# EAGLE schematic Fan__control_design (EAGLE 7.7.0)
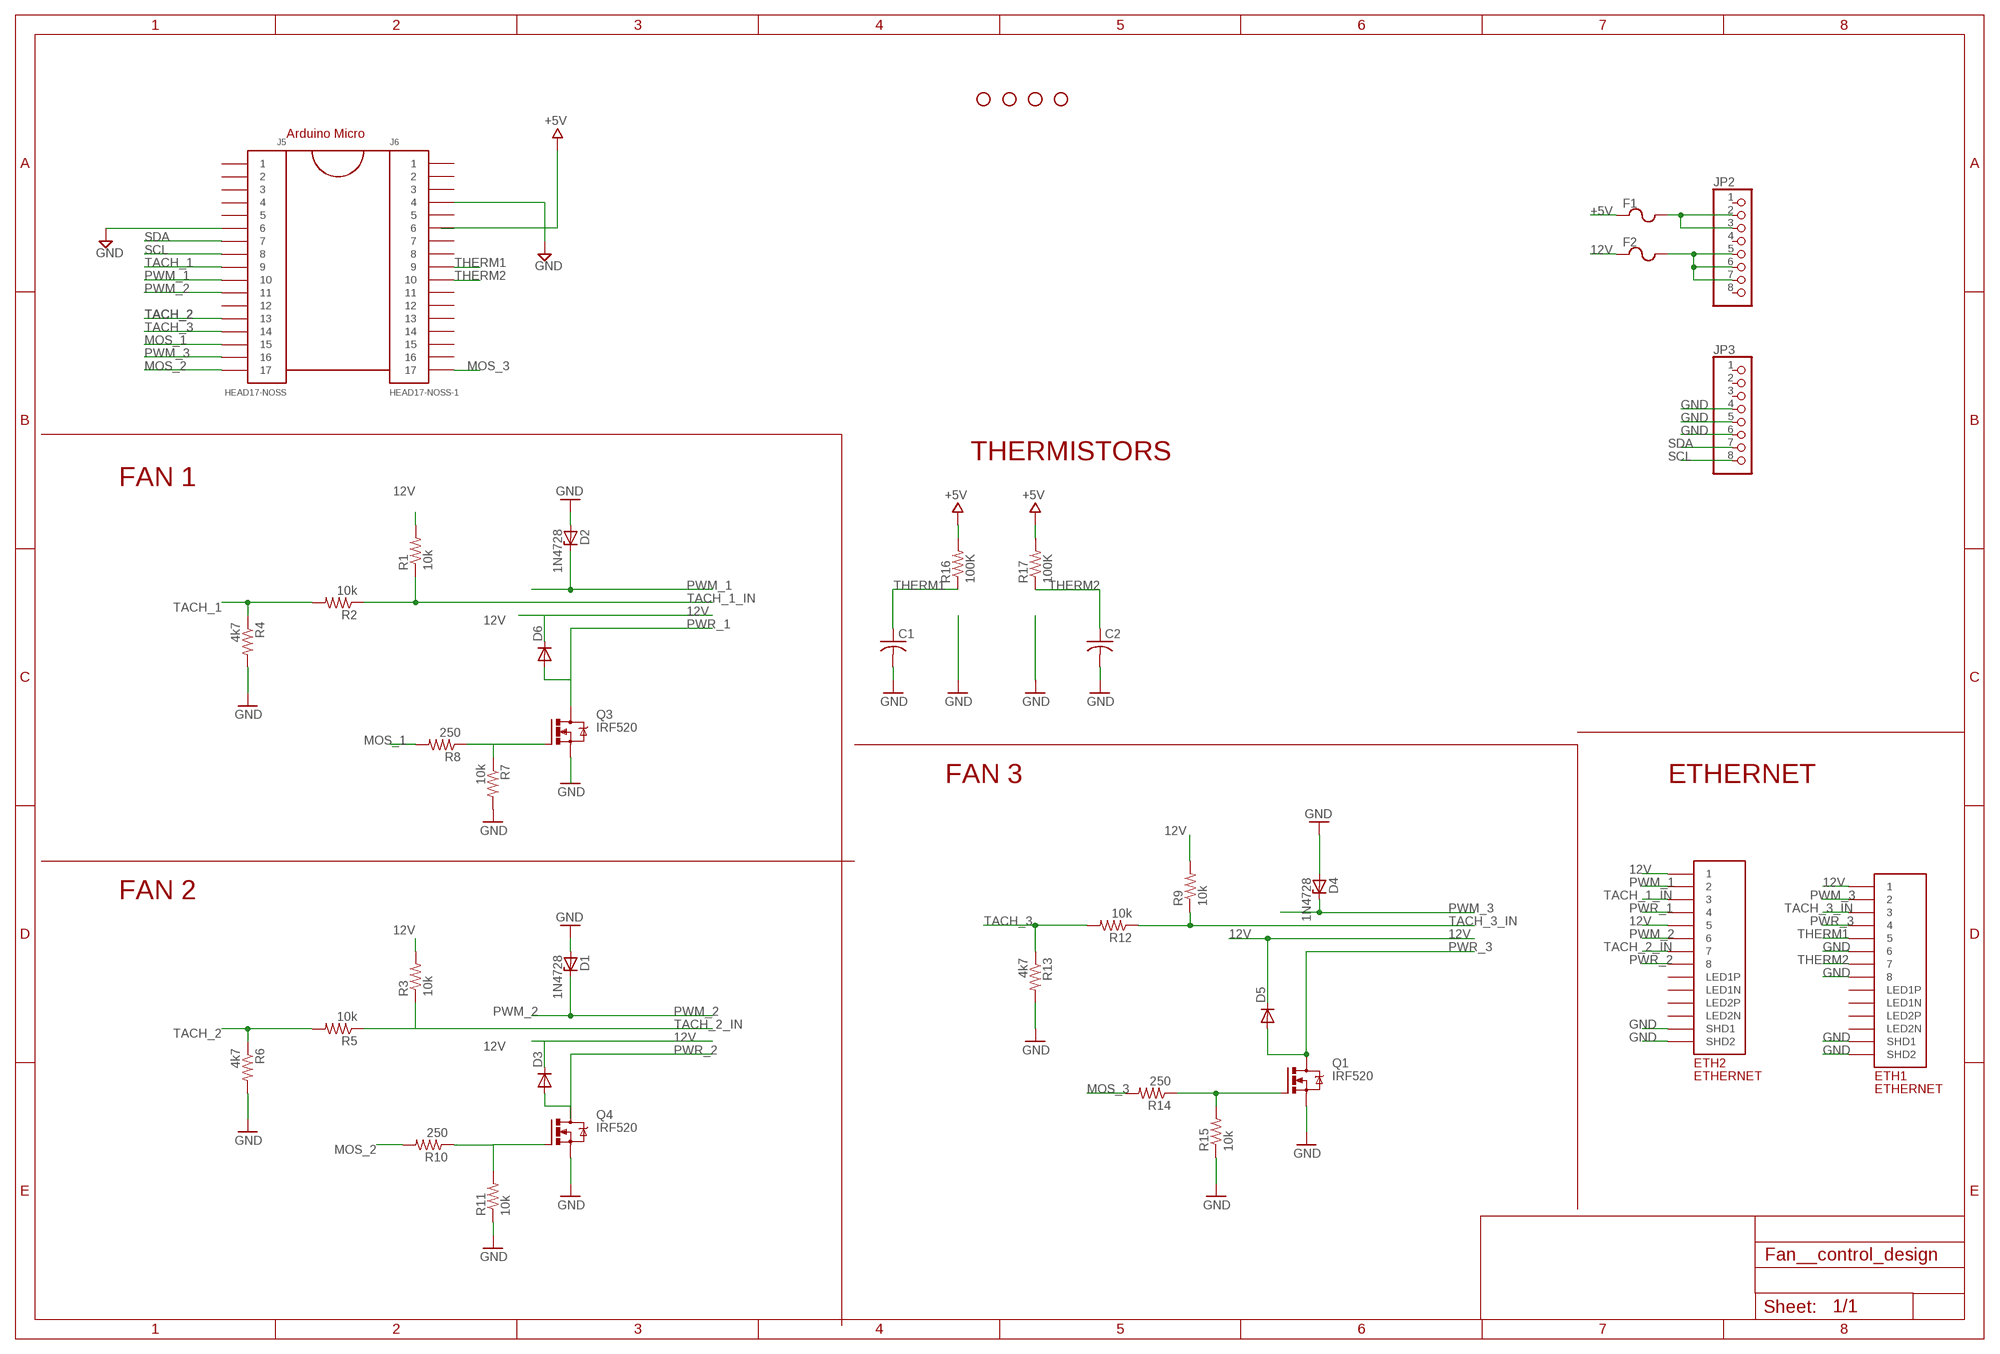
[diagram p0: schematic, sheet 1]

## Parts
C1  C-USC0603K  [C0603K]
C2  C-USC0603K  [C0603K]
D1  1N4728  [DO41Z10]
D2  1N4728  [DO41Z10]
D3  DIODE-DO214AC  [DO214AC]
D4  1N4728  [DO41Z10]
D5  DIODE-DO214AC  [DO214AC]
D6  DIODE-DO214AC  [DO214AC]
ETH1  ETHERNET  [A122645-ND]
ETH2  ETHERNET  [A122645-ND]
F1  POLYFUSE  [1206]
F2  POLYFUSE  [1206]
J5  HEAD17-NOSS  [HEAD17-NOSS]
J6  HEAD17-NOSS-1  [HEAD17-NOSS-1]
JP2  PINHD-1X8BIG  [1X08-BIG]
JP3  PINHD-1X8BIG  [1X08-BIG]
Q1  IRF520  [TO220BV]
Q3  IRF520  [TO220BV]
Q4  IRF520  [TO220BV]
R1  10k  R-US_R0603  [R0603]
R2  10k  R-US_R0603  [R0603]
R3  10k  R-US_R0603  [R0603]
R4  4k7  R-US_R0603  [R0603]
R5  10k  R-US_R0603  [R0603]
R6  4k7  R-US_R0603  [R0603]
R7  10k  R-US_R0603  [R0603]
R8  250  R-US_R0603  [R0603]
R9  10k  R-US_R0603  [R0603]
R10  250  R-US_R0603  [R0603]
R11  10k  R-US_R0603  [R0603]
R12  10k  R-US_R0603  [R0603]
R13  4k7  R-US_R0603  [R0603]
R14  250  R-US_R0603  [R0603]
R15  10k  R-US_R0603  [R0603]
R16  100K  R-US_R0603  [R0603]
R17  100K  R-US_R0603  [R0603]
STANDOFF1  STAND-OFF  [STAND-OFF]
STANDOFF2  STAND-OFF  [STAND-OFF]
STANDOFF3  STAND-OFF  [STAND-OFF]
STANDOFF4  STAND-OFF  [STAND-OFF]

## Nets
12V: D3.C D5.C D6.C ETH1.P$1 ETH2.P$1 ETH2.P$5 F2.1 R1.2 R3.2 R9.2
+5V: F1.1 J6.6 R16.2 R17.2
GND: C1.2 C2.2 D1.A D2.A D4.A ETH1.P$6 ETH1.P$8 ETH1.P$13(SHD1) ETH1.P$14(SHD2) ETH2.P$13(SHD1) ETH2.P$14(SHD2) J5.6 J6.4 JP3.4 JP3.5 JP3.6 Q1.S Q3.S Q4.S R4.2 R6.2 R7.2 R11.1 R13.2 R15.1
MOS_1: J5.15 R8.2
MOS_2: J5.17 R10.2
MOS_3: J6.17 R14.2
N$1: F1.2 JP2.2 JP2.3
N$2: F2.2 JP2.5 JP2.6 JP2.7
N$5: Q3.G R7.1 R8.1
N$8: Q4.G R10.1 R11.2
N$10: Q1.G R14.1 R15.2
PWM_1: D2.C ETH2.P$2 J5.10
PWM_2: D1.C ETH2.P$6 J5.11
PWM_3: D4.C ETH1.P$2 J5.16
PWR_1: D6.A ETH2.P$4 Q3.D
PWR_2: D3.A ETH2.P$8 Q4.D
PWR_3: D5.A ETH1.P$4 Q1.D
SCL: J5.8 JP3.8
SDA: J5.7 JP3.7
TACH_1: J5.9 R2.2 R4.1
TACH_1_IN: ETH2.P$3 R1.1 R2.1
TACH_2: J5.13 R5.2 R6.1
TACH_2_IN: ETH2.P$7 R3.1 R5.1
TACH_3: J5.14 R12.2 R13.1
TACH_3_IN: ETH1.P$3 R9.1 R12.1
THERM1: C1.1 ETH1.P$5 J6.9 R16.1
THERM2: C2.1 ETH1.P$7 J6.10 R17.1
Unconnected: ETH1.P$9(LED1N) ETH1.P$10(LED1P) ETH1.P$11(LED2N) ETH1.P$12(LED2P) ETH2.P$9(LED1N) ETH2.P$10(LED1P) ETH2.P$11(LED2N) ETH2.P$12(LED2P) J5.1 J5.2 J5.3 J5.4 J5.5 J5.12 J6.1 J6.2 J6.3 J6.5 J6.7 J6.8 J6.11 J6.12 J6.13 J6.14 J6.15 J6.16 JP2.1 JP2.4 JP2.8 JP3.1 JP3.2 JP3.3

## Notes on the sheet
- Arduino Micro
- THERMISTORS
- FAN 1
- FAN 3 | ETHERNET
- FAN 2

## Library data of the parts
C1 C2 = adafruit:C-US: CAPACITOR, American symbol
D1 D2 D4 = diode:1N4728: Z DIODE 3.3 V, 1W, 5 percent
D3 D5 D6 = diode:DIODE-: DIODE
ETH1 ETH2 = ETHERNET:ETHERNET: Ethernet port with 2 leds. digikey number A122645-ND
F1 F2 = polyfuse:POLYFUSE: Resistor Basic schematic elements and footprints for 0603, 1206, and PTH resistors.
J5 = SmartPrj:HEAD17-NOSS
J6 = SmartPrj:HEAD17-NOSS-1
JP2 JP3 = adafruit:PINHD-1X8: PIN HEADER
Q1 Q3 Q4 = transistor-power:IRF520: HEXFET Power MOSFET
R1-R17 = adafruit:R-US_: RESISTOR, American symbol
STANDOFF1-STANDOFF4 = SparkFun-Electromechanical:STAND-OFF: #4 Stand Off This is the mechanical footprint for a #4 phillips button head screw. Use the keepout ring to avoid running the screw head into surrounding components. SKU : PRT-00447

## Net classes
0 default: width 0.254 mm, drill 0.61 mm, clearance 0.203 mm